# Altium project DC075B.PrjPcb (part 1 of 7)
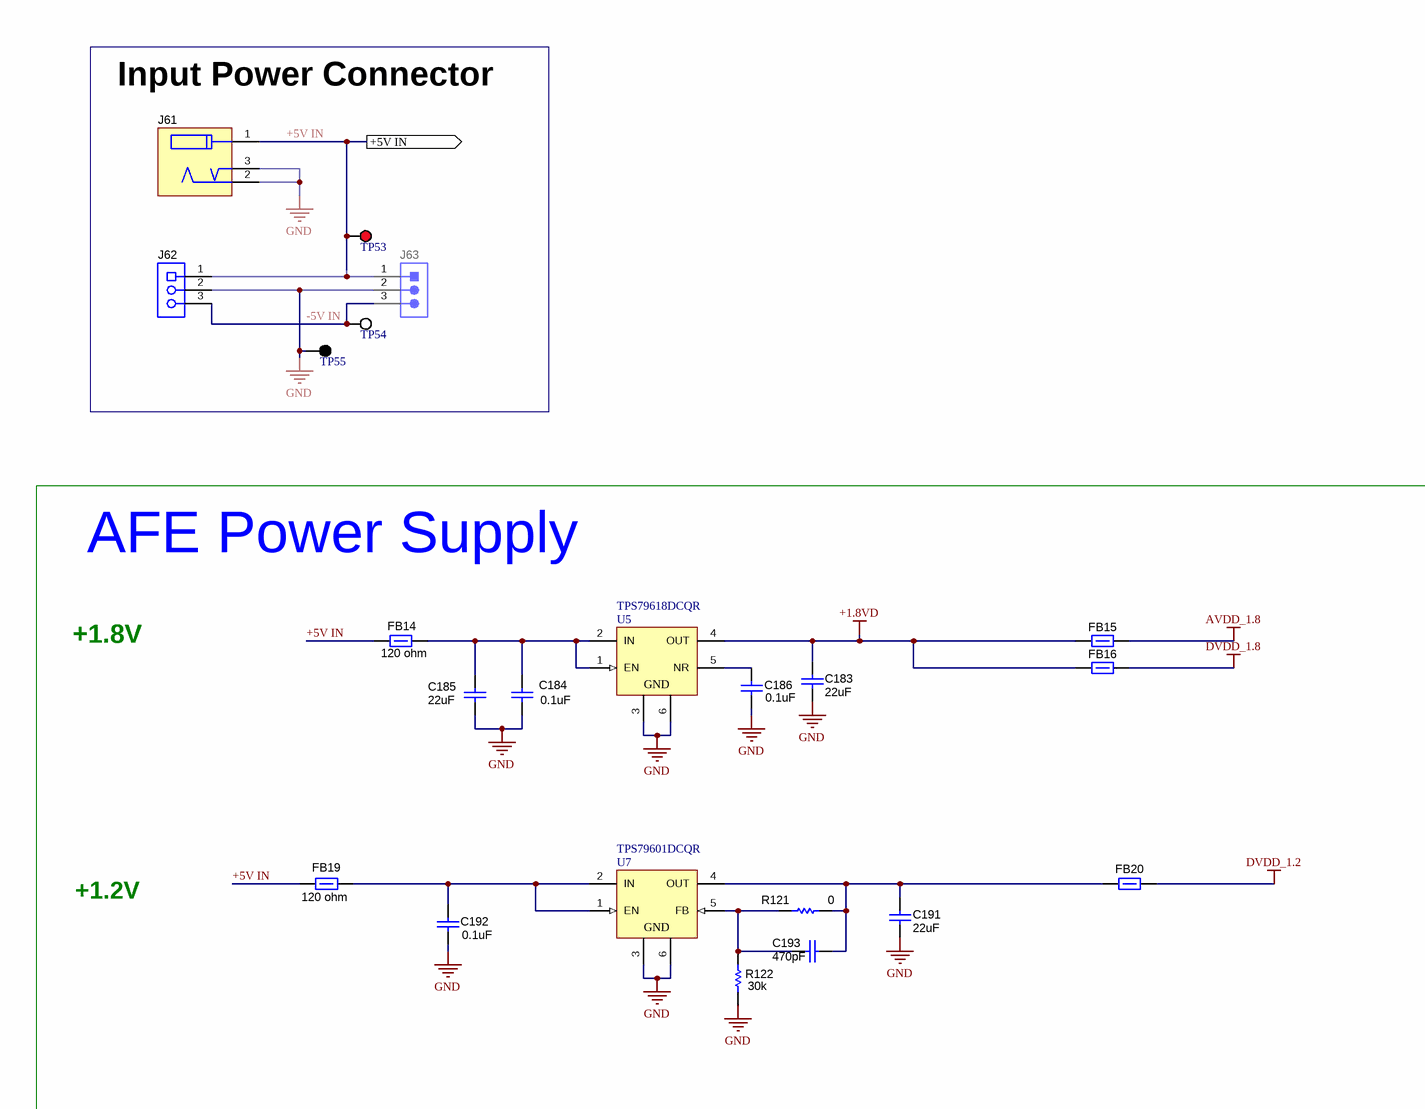
[diagram p0: DC075B_POWER_SUPPLIES.SchDoc, top left]
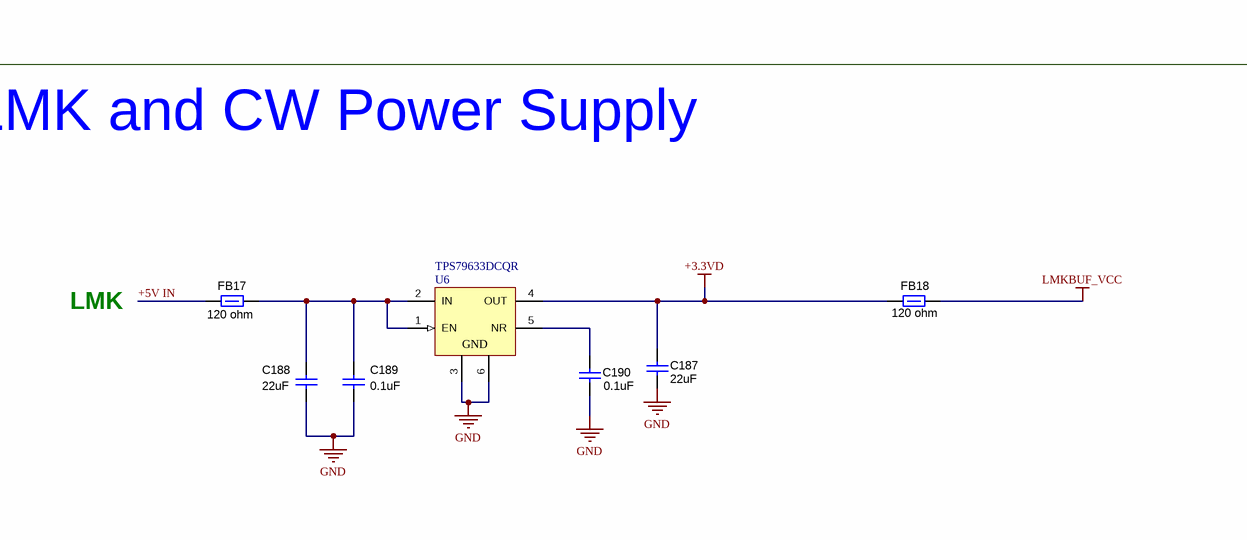
[diagram p1: DC075B_POWER_SUPPLIES.SchDoc, top right]
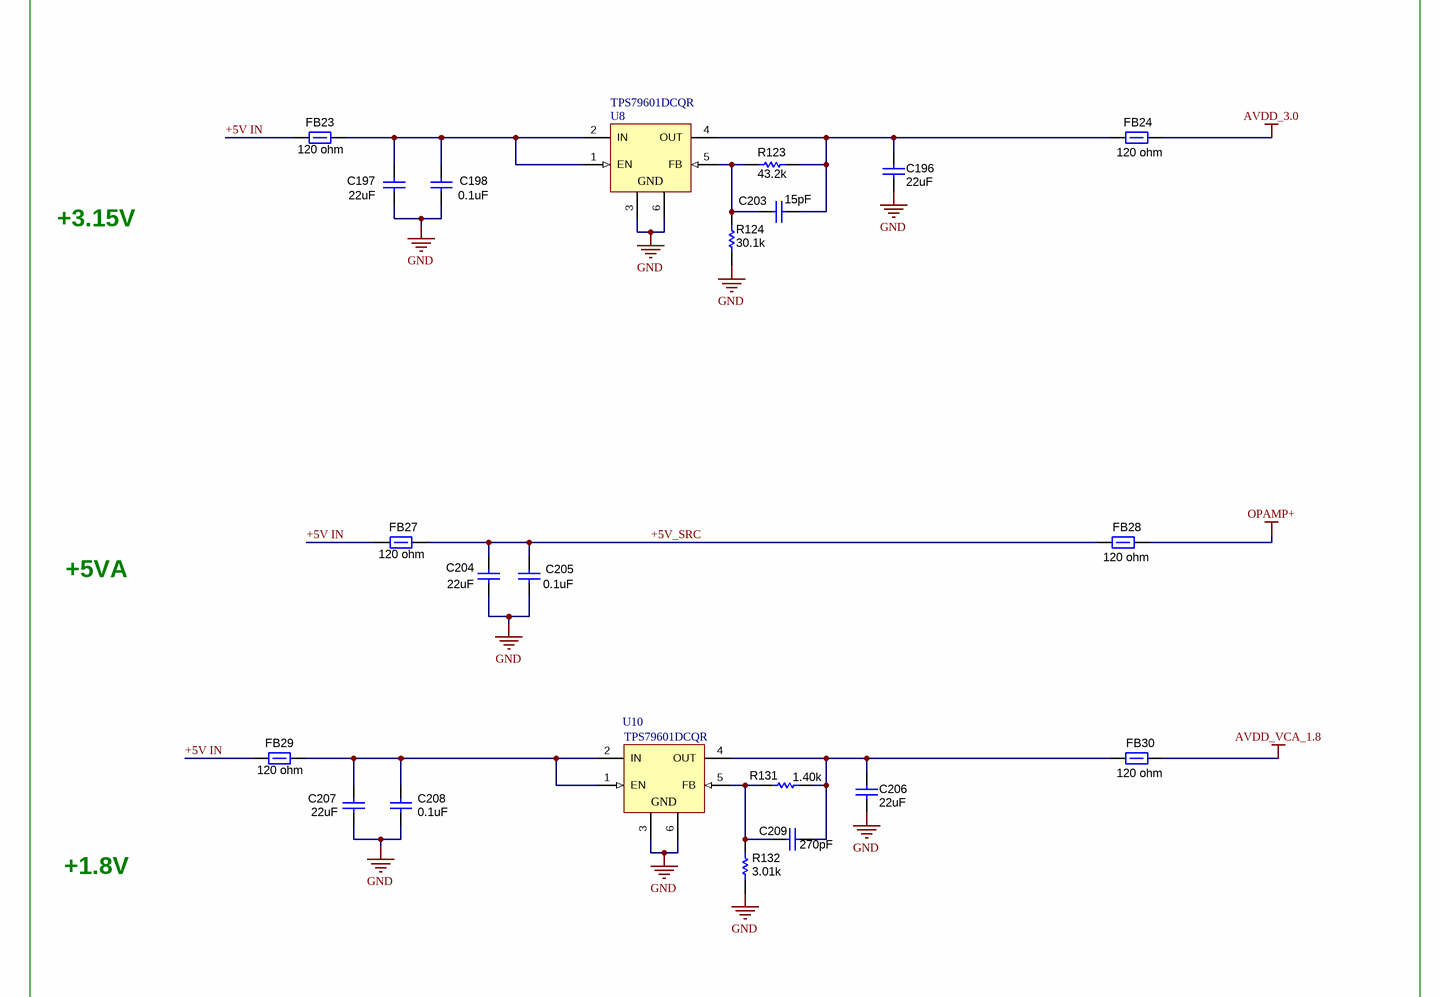
[diagram p2: DC075B_POWER_SUPPLIES.SchDoc, bottom left]
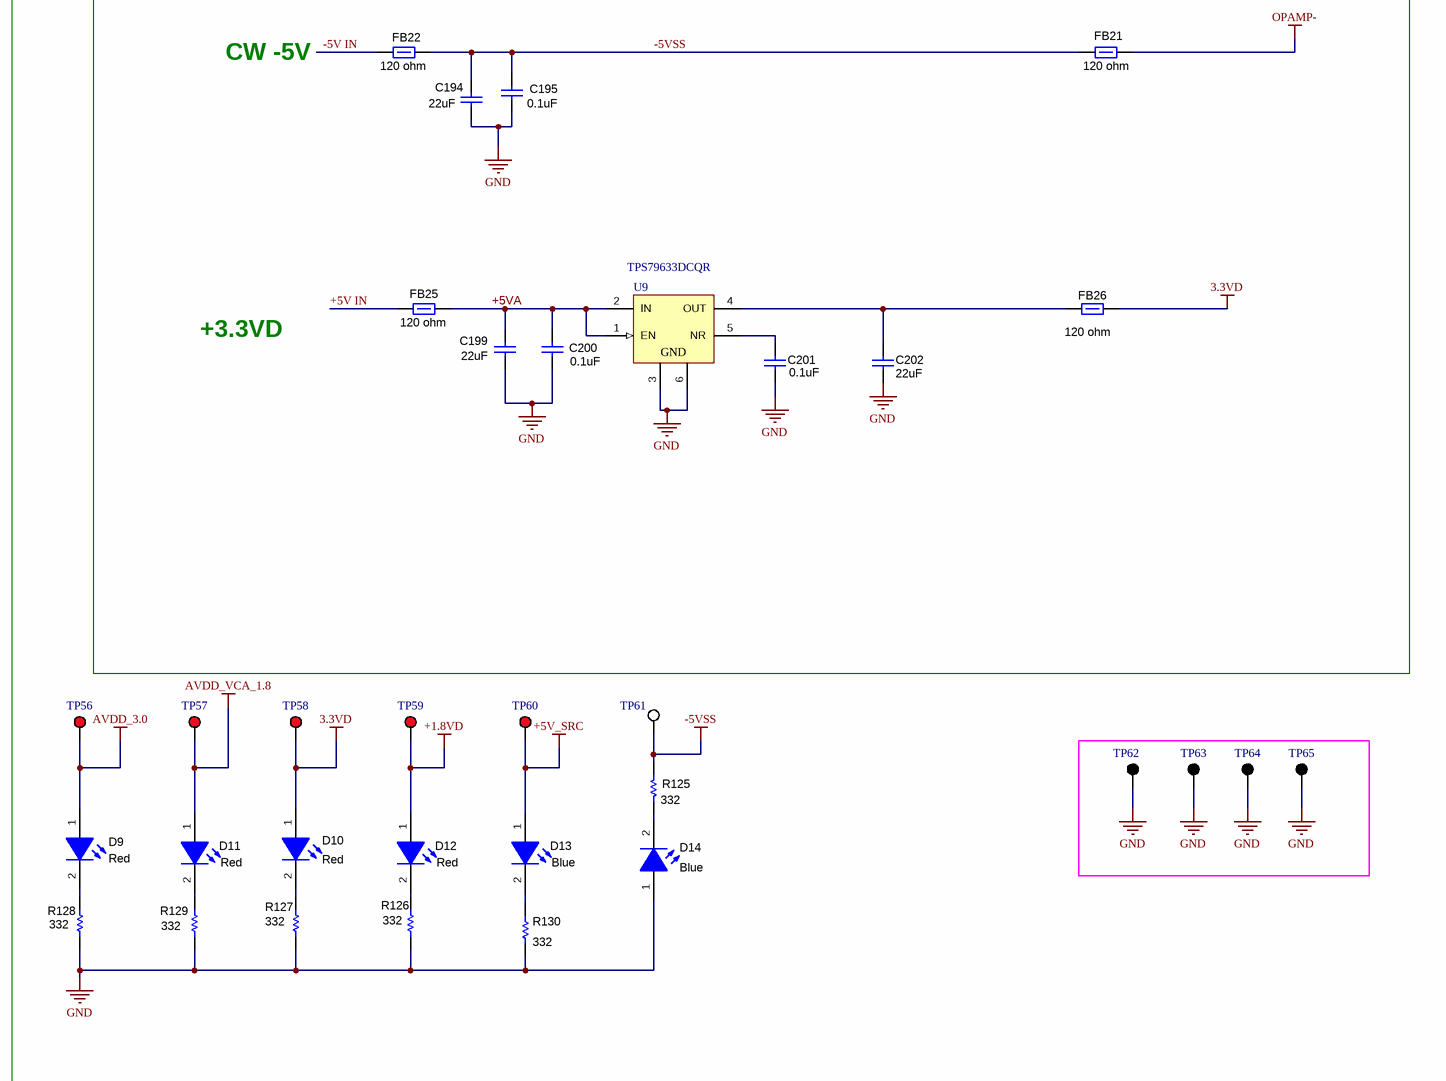
[diagram p3: DC075B_POWER_SUPPLIES.SchDoc, bottom right]
CopyrightYear: 2018; PCB_Layout: Tessolve; PCB_Rev: A; PRJ_Customer: Public Release; PRJ_Engineer: Praveen Aroul; PRJ_Number: DC075; PRJ_Title: AFE58JD32LP/AFE5832LP; SCH_Rev: B; TechSupport: http://www.ti.com/support; TID: N/A
13 sheets, 712 parts. Net scope: flat (ports and power ports of the same name join across sheets).
Board file: DC075B.PcbDoc
Sheets:
  DC075B_POWER_SUPPLIES.SchDoc
  DC075B_USB.SchDoc
  DC075B_INPUT_CLOCKS.SchDoc
  DC075B_LMK_CLOCK_CIRCUIT.SchDoc
  DC075B_ANALOG_INPUTS.SchDoc
  DC075B_DEVICE_PINOUT.SchDoc
  DC075B_DECOUPLING.SchDoc
  DC075B_TGC_SOURCE.SchDoc
  DC075B_DTGC_CPLD.SchDoc
  DC075B_LVDS_OUTPUT.SchDoc
  DC075B_JESD_OUTPUT.SchDoc
  DC075B_CW_OUTPUTS.SchDoc
  DC075B_HARDWARE.SchDoc

## Sheet DC075B_POWER_SUPPLIES.SchDoc: POWER SUPPLIES
size 558 x 431 mm; DrawnBy: Praveen Aroul; DocumentNumber: 1; SheetNumber: 1; SheetTotal: 13; PageSetup: Record=PageOptions|CenterHorizontal=True|CenterVertical=True|PrintScale=1.00|XCorrection=1.00|YCorrection=1.00|PrintKind=0|BorderSize=5000000|LeftOffset=0|BottomOffset=0|Orientation=2|PaperLength=1000|PaperWidth=1000|Scale=100|PaperSource=15|PrintQuality=600|MediaType=1|DitherType=10|PaperKind=Letter|PrintScaleMode=1

### Parts
C183  ValueDisplayed: 22uF  [0603]  (hidden comment: GRM187R61A226ME15D)
C184  value 0.1uF  [0603]  (hidden comment: CL10A104KA8NNNC)
C185  ValueDisplayed: 22uF  [1206_190]  (hidden comment: 1206YD226MAT2A)
C186  value 0.1uF  [0603]  (hidden comment: CL10A104KA8NNNC)
C187  ValueDisplayed: 22uF  [0603]  (hidden comment: GRM187R61A226ME15D)
C188  ValueDisplayed: 22uF  [1206_190]  (hidden comment: 1206YD226MAT2A)
C189  value 0.1uF  [0603]  (hidden comment: CL10A104KA8NNNC)
C190  value 0.1uF  [0603]  (hidden comment: CL10A104KA8NNNC)
C191  ValueDisplayed: 22uF  [0603]  (hidden comment: GRM187R61A226ME15D)
C192  value 0.1uF  [0603]  (hidden comment: CL10A104KA8NNNC)
C193  value 470pF  [0603]  (hidden comment: 06035A471JAT2A)
C194  ValueDisplayed: 22uF  [1206_190]  (hidden comment: 1206YD226MAT2A)
C195  value 0.1uF  [0603]  (hidden comment: CL10A104KA8NNNC)
C196  ValueDisplayed: 22uF  [0603]  (hidden comment: GRM187R61A226ME15D)
C197  ValueDisplayed: 22uF  [1206_190]  (hidden comment: 1206YD226MAT2A)
C198  value 0.1uF  [0603]  (hidden comment: CL10A104KA8NNNC)
C199  ValueDisplayed: 22uF  [1206_190]  (hidden comment: 1206YD226MAT2A)
C200  value 0.1uF  [0603]  (hidden comment: CL10A104KA8NNNC)
C201  value 0.1uF  [0603]  (hidden comment: CL10A104KA8NNNC)
C202  ValueDisplayed: 22uF  [0603]  (hidden comment: GRM187R61A226ME15D)
C203  ValueDisplayed: 15pF  [0603]  (hidden comment: 06035A150JAT2A)
C204  ValueDisplayed: 22uF  [1206_190]  (hidden comment: 1206YD226MAT2A)
C205  value 0.1uF  [0603]  (hidden comment: CL10A104KA8NNNC)
C206  ValueDisplayed: 22uF  [0603]  (hidden comment: GRM187R61A226ME15D)
C207  ValueDisplayed: 22uF  [1206_190]  (hidden comment: 1206YD226MAT2A)
C208  value 0.1uF  [0603]  (hidden comment: CL10A104KA8NNNC)
C209  Cap_F: 270pF  [0603]  (hidden comment: C0603C271K5RACTU)
D9  value Red  [LED_LTST-C190_Red]  (hidden comment: LTST-C190CKT)
D10  value Red  [LED_LTST-C190_Red]  (hidden comment: LTST-C190CKT)
D11  value Red  [LED_LTST-C190_Red]  (hidden comment: LTST-C190CKT)
D12  value Red  [LED_LTST-C190_Red]  (hidden comment: LTST-C190CKT)
D13  value Blue  [LB Q39G_BLUE]  (hidden comment: LB Q39G-L2N2-35-1)
D14  value Blue  [LB Q39G_BLUE]  (hidden comment: LB Q39G-L2N2-35-1)
FB14  value 120 ohm  [0805]  (hidden comment: BLM21AG121SN1D)
FB15  BLM21AG121SN1D  [0805]  (value not drawn)
FB16  BLM21AG121SN1D  [0805]  (value not drawn)
FB17  value 120 ohm  [0805]  (hidden comment: BLM21AG121SN1D)
FB18  value 120 ohm  [0805]  (hidden comment: BLM21AG121SN1D)
FB19  value 120 ohm  [0805]  (hidden comment: BLM21AG121SN1D)
FB20  BLM21AG121SN1D  [0805]  (value not drawn)
FB21  value 120 ohm  [0805]  (hidden comment: BLM21AG121SN1D)
FB22  value 120 ohm  [0805]  (hidden comment: BLM21AG121SN1D)
FB23  value 120 ohm  [0805]  (hidden comment: BLM21AG121SN1D)
FB24  value 120 ohm  [0805]  (hidden comment: BLM21AG121SN1D)
FB25  value 120 ohm  [0805]  (hidden comment: BLM21AG121SN1D)
FB26  value 120 ohm  [0805]  (hidden comment: BLM21AG121SN1D)
FB27  value 120 ohm  [0805]  (hidden comment: BLM21AG121SN1D)
FB28  value 120 ohm  [0805]  (hidden comment: BLM21AG121SN1D)
FB29  value 120 ohm  [0805]  (hidden comment: BLM21AG121SN1D)
FB30  value 120 ohm  [0805]  (hidden comment: BLM21AG121SN1D)
J61  RAPC722X  [CONN_RAPC722X]  (value not drawn)
J62  ED555/3DS  [TERM_BLK_ED555-3DS]  (value not drawn)
J63  TSW-103-07-G-S  [TSW-103-07-G-S]  (value not drawn)
R121  value 0  [0805_HV]  (hidden comment: CRCW08050000Z0EA)
R122  value 30k  [0805_HV]  (hidden comment: CRCW080530K0JNEA)
R123  ValueDisplayed: 43.2k  [0603]  (hidden comment: RC0603FR-0743K2L)
R124  ValueDisplayed: 30.1k  [0603]  (hidden comment: CRCW060330K1FKEA)
R125  value 332  [0402]  (hidden comment: CRCW0402332RFKED)
R126  value 332  [0402]  (hidden comment: CRCW0402332RFKED)
R127  value 332  [0402]  (hidden comment: CRCW0402332RFKED)
R128  value 332  [0402]  (hidden comment: CRCW0402332RFKED)
R129  value 332  [0402]  (hidden comment: CRCW0402332RFKED)
R130  value 332  [0402]  (hidden comment: CRCW0402332RFKED)
R131  ValueDisplayed: 1.40k  [0603]  (hidden comment: CRCW06031K40FKEA)
R132  value 3.01k  [0603]  (hidden comment: CRCW06033K01FKEA)
TP53  5000  [Keystone5000]  (value not drawn)
TP54  5002  [Keystone5002]  (value not drawn)
TP55  5001  [Keystone5001]  (value not drawn)
TP56  5000  [Keystone5000]  (value not drawn)
TP57  5000  [Keystone5000]  (value not drawn)
TP58  5000  [Keystone5000]  (value not drawn)
TP59  5000  [Keystone5000]  (value not drawn)
TP60  5000  [Keystone5000]  (value not drawn)
TP61  5002  [Keystone5002]  (value not drawn)
TP62  5001  [Keystone5001]  (value not drawn)
TP63  5001  [Keystone5001]  (value not drawn)
TP64  5001  [Keystone5001]  (value not drawn)
TP65  5001  [Keystone5001]  (value not drawn)
U5  TPS79618DCQR  [DCQ0006A_N]
U6  TPS79633DCQR  [DCQ0006A_N]
U7  TPS79601DCQR  [DCQ0006A_N]
U8  TPS79601DCQR  [DCQ0006A_N]
U9  TPS79633DCQR  [DCQ0006A_N]
U10  TPS79601DCQR  [DCQ0006A_N]

### Blocks framed on the sheet
Input Power Connector: J61-J63 TP53-TP55
AFE Power Supply: C183-C186 C191-C193 C196-C198 C203-C209 FB14-FB16 FB19 FB20 FB23 FB24 FB27-FB30 R121-R124 R131 R132 U5 U7 U8 U10
LMK and CW Power Supply: C187-C190 C194 C195 C199-C202 FB17 FB18 FB21 FB22 FB25 FB26 U6 U9

### Ports
+5V IN (out)

### Nets
3.3VD: D10.1(A) FB26.2 TP58.1
+1.8VD: C183.1 D12.1(A) FB15.1 FB16.1 TP59.1 U5.4(OUT)
+3.3VD: C187.1 FB18.1 U6.4(OUT)
+5V_SRC: C204.2 C205.1 D13.1(A) FB27.2 FB28.1 TP60.1
-5VSS: C194.2 C195.1 FB21.1 FB22.2 R125.1 TP61.1
AVDD_1.8: FB15.2
AVDD_3.0: D9.1(A) FB24.2 TP56.1
AVDD_VCA_1.8: D11.1(A) FB30.2 TP57.1
DVDD_1.2: FB20.2
DVDD_1.8: FB16.2
GND: C183.2 C184.2 C185.1 C186.2 C187.2 C188.1 C189.2 C190.2 C191.2 C192.2 C194.1 C195.2 C196.2 C197.1 C198.2 C199.1 C200.2 C201.2 C202.2 C204.1 C205.2 C206.2 C207.1 C208.2 D14.1(A) J61.2 J61.3 J62.2 J63.2 R122.1 R124.2 R126.1 R127.1 R128.1 R129.1 R130.1 R132.1 TP55.1 TP62.1 TP63.1 TP64.1 TP65.1 U5.3(GND) U5.6(GND) U6.3(GND) U6.6(GND) U7.3(GND) U7.6(GND) U8.3(GND) U8.6(GND) U9.3(GND) U9.6(GND) U10.3(GND) U10.6(GND)
LMKBUF_VCC: FB18.2
OPAMP+: FB28.2
OPAMP-: FB21.2
+5V IN: FB14.1 FB17.1 FB19.1 FB23.1 FB25.1 FB27.1 FB29.1 J61.1 J62.1 J63.1 TP53.1 ; port +5V IN
+5VA: C199.2 C200.1 FB25.2 U9.1(EN) U9.2(IN)
-5V IN: FB22.1 J62.3 J63.3 TP54.1
NetC184_1: C184.1 C185.2 FB14.2 U5.1(EN) U5.2(IN)
NetC186_1: C186.1 U5.5(NR)
NetC188_2: C188.2 C189.1 FB17.2 U6.1(EN) U6.2(IN)
NetC190_1: C190.1 U6.5(NR)
NetC191_1: C191.1 C193.1 FB20.1 R121.2 U7.4(OUT)
NetC192_1: C192.1 FB19.2 U7.1(EN) U7.2(IN)
NetC193_2: C193.2 R121.1 R122.2 U7.5(FB)
NetC196_1: C196.1 C203.1 FB24.1 R123.2 U8.4(OUT)
NetC197_2: C197.2 C198.1 FB23.2 U8.1(EN) U8.2(IN)
NetC201_1: C201.1 U9.5(NR)
NetC202_1: C202.1 FB26.1 U9.4(OUT)
NetC203_2: C203.2 R123.1 R124.1 U8.5(FB)
NetC206_1: C206.1 C209.1 FB30.1 R131.2 U10.4(OUT)
NetC207_2: C207.2 C208.1 FB29.2 U10.1(EN) U10.2(IN)
NetC209_2: C209.2 R131.1 R132.2 U10.5(FB)
NetD9_2: D9.2(K) R128.2
NetD10_2: D10.2(K) R127.2
NetD11_2: D11.2(K) R129.2
NetD12_2: D12.2(K) R126.2
NetD13_2: D13.2(K) R130.2
NetD14_2: D14.2(K) R125.2

### Notes on the sheet
- +1.8V
- LMK
- +1.2V
- CW -5V
- +3.15V
- +3.3VD
- +5VA
- Drawn By:
- SVN Rev:
- Number:
- TID #:
- Orderable:
- Rev:
- Sheet Title:
- File:
- Project Title:
- Designed for:
- Assembly Variant:
- Mod. Date:
- Sheet:
- Size:
- of
- C
- http://www.ti.com
- Texas Instruments and/or its licensors do not warrant the accuracy or completeness of this specification or any information contained therein. Texas Instruments and/or its licensors do not warrant that this design will meet the specifications, will be suitable for your application or fit for any particular purpose, or will operate in an implementation. Texas Instruments and/or its licensors do not warrant that the design is production worthy. You should completely validate and test your design implementation to confirm the system functionality for your application.
- Engineer:
- Contact:
- © Texas Instruments

### Library data of the parts
C183 C187 C191 C196 C202 C206 = CMP-0007158-5: CAP, CERM, 22 uF, 10 V, +/- 20%, X5R, 0603; Manufacturer: MuRata; Polarized: N; Value: 22uF; U/M: EA; Cap_F: 22µF; Value1: Unknown; VDC_V: 10V; TaMin_C: -55°C; TaMax_C: 85°C; AEC Category: Q200; SizeArea_mm2: 1.28; SizeAreaWB_mm2: 4.68; SizeX_mm: 1.6; SizeY_mm: 0.8; SizeZ_mm: 1; CompType: Capacitor; PartNumber: GRM187R61A226ME15D; PackageReference: 0603; RoHS: Y; Tolerance_%: 20%; Value2: 10V; MountType: SMT; Technology: Ceramic; TempCo: X5R; Cap_Case: 0603; Published: 2008-06-19; Publisher: Texas Instruments; LatestRevisionDate: 2017-03-09; ComponentLink1Description: Datasheet link; ComponentLink1URL: http://psearch.en.murata.com/capacitor/product/GRM187R61A226ME15%23.pdf; Supplier 1: Digi-Key; Supplier Part Number 1: 490-13243-1-ND; Supplier 2: Mouser; Supplier Part Number 2: 81-GRM187R61A226ME5D; AEC Qualified: N; AEC Grade: N/A
C184 C186 C189 C190 C192 C195 C198 C200 C201 C205 C208 = CMP-0085577-2: CAP, CERM, 0.1 µF, 25 V,+/- 10%, X5R, 0603; Manufacturer: Samsung Electro-Mechanics; Polarized: N; ValueDisplayed: 0.1µF; U/M: EA; Cap_F: 100nF; VDC_V: 25V; TaMin_C: -55°C; TaMax_C: 85°C; AEC Category: Q200; SizeArea_mm2: 1.28; SizeAreaWB_mm2: 4.68; SizeX_mm: 1.6; SizeY_mm: 0.8; SizeZ_mm: 1; Green_REACh: Incomplete; Green_Lifecycle: Active; CompType: Capacitor; PartNumber: CL10A104KA8NNNC; PackageReference: 0603; RoHS: Y; Tolerance_%: 10%; Value2: 25V; MountType: SMT; Technology: Ceramic; TempCo: X5R; Cap_Case: 0603; ComponentLink1Description: Datasheet link; ComponentLink1URL: http://www.samsungsem.com/kr/support/product-search/mlcc/__icsFiles/afieldfile/2018/06/20/CL10A104KA8NNNC.pdf; AEC Grade: N/A; AEC Qualified: N; Green_EU RoHS: Passed; Green_EU RoHS-2: Incomplete
C185 C188 C194 C197 C199 C204 C207 = CMP-0008571-2: CAP, CERM, 22 uF, 16 V, +/- 20%, X5R, 1206_190; Manufacturer: AVX; Polarized: N; Value: 22uF; U/M: EA; Cap_F: 22µF; Value1: Unknown; VDC_V: 16V; TaMin_C: -55°C; TaMax_C: 85°C; Cap_Case: 1206; AEC Category: Q200; SizeArea_mm2: 5.12; SizeAreaWB_mm2: 10.92; SizeX_mm: 3.2; SizeY_mm: 1.6; SizeZ_mm: 1.9; CompType: Capacitor; PartNumber: 1206YD226MAT2A; PackageReference: 1206_190; RoHS: Y; Tolerance_%: 20%; Value2: 16V; MountType: SMT; Technology: Ceramic; TempCo: X5R; Published: 2008-06-19; Publisher: Texas Instruments; LatestRevisionDate: 2017-03-09; ComponentLink1Description: Datasheet link; ComponentLink1URL: http://www.avx.com/docs/Catalogs/cx5r.pdf; Supplier 1: Digi-Key; Supplier Part Number 1: 478-5332-1-ND; Supplier 2: Newark; Supplier Part Number 2: 85R5734; Supplier 3: Mouser; Supplier Part Number 3: 581-1206YD226MAT2A; AEC Grade: N/A; AEC Qualified: N
C193 = CMP-0006790-4: CAP, CERM, 470 pF, 50 V, +/- 5%, C0G/NP0, 0603; Manufacturer: AVX; Polarized: N; U/M: EA; ESR_ohm: 0.063; Value1: 0.063 ohm; VDC_V: 50V; TaMin_C: -55°C; TaMax_C: 125°C; AEC Category: Q200; SizeArea_mm2: 1.28; SizeAreaWB_mm2: 4.68; SizeX_mm: 1.6; SizeY_mm: 0.8; SizeZ_mm: 1; CompType: Capacitor; PartNumber: 06035A471JAT2A; PackageReference: 0603; RoHS: Y; Cap_F: 470pF; Tolerance_%: 5%; Value2: 50V; MountType: SMT; Technology: Ceramic; TempCo: C0G/NP0; Cap_Case: 0603; Published: 2008-06-19; Publisher: Texas Instruments; LatestRevisionDate: 2017-03-09; ComponentLink1Description: Datasheet link; ComponentLink1URL: http://datasheets.avx.com/C0GNP0-Dielectric.pdf; Supplier 1: Digi-Key; Supplier Part Number 1: 478-1183-1-ND; Supplier 2: Newark; Supplier Part Number 2: 96M1279; Supplier 3: Mouser; Supplier Part Number 3: 581-06035A471J; AEC Grade: N/A; AEC Qualified: N; ValueDisplayed: 470pF
C203 = CMP-0006767-4: CAP, CERM, 15 pF, 50 V, +/- 5%, C0G/NP0, 0603; Manufacturer: AVX; Polarized: N; Value: 15pF; U/M: EA; ESR_ohm: 3.2d; Value1: 0.32 ohm; VDC_V: 50V; TaMin_C: -55°C; TaMax_C: 125°C; AEC Category: Q200; SizeArea_mm2: 1.28; SizeAreaWB_mm2: 4.68; SizeX_mm: 1.6; SizeY_mm: 0.8; SizeZ_mm: 1; CompType: Capacitor; PartNumber: 06035A150JAT2A; PackageReference: 0603; RoHS: Y; Cap_F: 15pF; Tolerance_%: 5%; Value2: 50V; MountType: SMT; Technology: Ceramic; TempCo: C0G/NP0; Cap_Case: 0603; Published: 2008-06-19; Publisher: Texas Instruments; LatestRevisionDate: 2017-03-09; ComponentLink1Description: Datasheet link; ComponentLink1URL: http://datasheets.avx.com/C0GNP0-Dielectric.pdf; Supplier 1: Digi-Key; Supplier Part Number 1: 478-1165-1-ND; Supplier 2: Newark; Supplier Part Number 2: 17C6475; Supplier 3: Mouser; Supplier Part Number 3: 581-06035A150J; AEC Grade: N/A; AEC Qualified: N
C209 = CMP-0006911-4: CAP, CERM, 270 pF, 50 V, +/- 10%, X7R, 0603; Manufacturer: Kemet; TaMin_C: -55°C; Polarized: N; SizeAreaWB_mm2: 4.68; Value1: Unknown; U/M: EA; Value: 270pF; TaMax_C: 125°C; SizeZ_mm: 1; SizeX_mm: 1.6; SizeY_mm: 0.8; Value2: 50V; SizeArea_mm2: 1.28; AEC Category: Q200; Supplier Part Number 2: 80-C0603C271K5R; Publisher: Texas Instruments; Supplier 2: Mouser; Supplier Part Number 3: 1758179; TempCo: X7R; Supplier 3: Farnell; Published: 2008-06-19; RoHS: Y; MountType: SMT; Supplier 1: Digi-Key; PackageReference: 0603; Tolerance_%: 10%; Cap_Case: 0603; CompType: Capacitor; LatestRevisionDate: 2017-03-09; PartNumber: C0603C271K5RACTU; AEC Qualified: ?; VDC_V: 50V; ComponentLink1Description: Datasheet link; Supplier Part Number 1: 399-1072-1-ND; Technology: Ceramic; ValueDisplayed: 270pF; ComponentLink1URL: http://www.kemet.com/kemet/web/homepage/kechome.nsf/vapubfiles/F3102_Y5V.pdf/$file/F3102_Y5V.pdf
D9-D12 = CMP-0002842-2: LED, Red, SMD; Manufacturer: Lite-On; Vf_V: 2V; Io_A: 20mA; Tjmax_C: 85°C; Power_TotalModule: 62.5mW; Value1: 0.0625W; CompType: LED; MountType: SMT; ComponentLink1URL: http://optoelectronics.liteon.com/en-us/api/DwonloadFileHandler.ashx?txtSpecNo=DS-22-98-0009&txtPartNo=LTST-C190CKT; ComponentLink1Description: Datasheet link; PackageReference: Red LED, 1.6x0.8x0.8mm; PartNumber: LTST-C190CKT; RoHS: Y; Type: ?; Value2: 2V; Color: red
D13 D14 = CMP-0002849-2: LED, Blue, SMD; Manufacturer: OSRAM; Vf_V: 2.85V; Io_A: 1.5dA; Tjmax_C: 95°C; Value1: W; CompType: LED; MountType: SMT; ComponentLink1URL: http://catalog.osram-os.com/catalogue/catalogue.do;jsessionid=8F4D5D14036503CDC6D844D9AC77EBC1?act=downloadFile&favOid=02000006000372cb000100b6; ComponentLink1Description: Datasheet link; PackageReference: BLUE 0603 LED; PartNumber: LB Q39G-L2N2-35-1; RoHS: Y; Type: ?; Value2: 2.85V; Color: blue
FB14 FB17-FB19 FB21-FB30 = CMP-0003358-1: Ferrite Bead, 120 ohm @ 100 MHz, 0.8 A, 0805; Manufacturer: MuRata; Imax_A: 8dA; DCR_ohm: 1d; Value1: 0.1 ohm; Value2: 0.8A; ZTyp@100MHz_Ohm: 120; SizeArea_mm2: 2.5; SizeAreaWB_mm2: 6.75; SizeX_mm: 2; SizeY_mm: 1.25; SizeZ_mm: 1.45; ComponentLink1Description: Datasheet link; ComponentLink1URL: http://search.murata.co.jp/Ceramy/image/img/PDF/ENG/L0110S0100BLM21A.pdf; CompType: Ferrite Bead; MountType: SMT; PackageReference: 0805; PartNumber: BLM21AG121SN1D; RoHS: Y; Published: 2014-04-30; Publisher: Texas Instruments; LatestRevisionDate: 2017-03-09; Supplier 1: Digi-Key; Supplier Part Number 1: 490-1038-1-ND; Supplier 2: Newark; Supplier Part Number 2: 73M9128; Supplier 3: Mouser; Supplier Part Number 3: 81-BLM21AG121SN1D; ValueDisplayed: 120 ohm
FB15 FB16 FB20 = CMP-0003358-1: Ferrite Bead, 120 ohm @ 100 MHz, 0.8 A, 0805; Manufacturer: MuRata; Value: 120 ohm; Imax_A: 8dA; DCR_ohm: 1d; Value1: 0.1 ohm; Value2: 0.8A; ZTyp@100MHz_Ohm: 120; SizeArea_mm2: 2.5; SizeAreaWB_mm2: 6.75; SizeX_mm: 2; SizeY_mm: 1.25; SizeZ_mm: 1.45; ComponentLink1Description: Datasheet link; ComponentLink1URL: http://search.murata.co.jp/Ceramy/image/img/PDF/ENG/L0110S0100BLM21A.pdf; CompType: Ferrite Bead; MountType: SMT; PackageReference: 0805; PartNumber: BLM21AG121SN1D; RoHS: Y; Published: 2014-04-30; Publisher: Texas Instruments; LatestRevisionDate: 2017-03-09; Supplier 1: Digi-Key; Supplier Part Number 1: 490-1038-1-ND; Supplier 2: Newark; Supplier Part Number 2: 73M9128; Supplier 3: Mouser; Supplier Part Number 3: 81-BLM21AG121SN1D; ValueDisplayed: 120 ohm
J61 = CMP-0074940-1: Power Jack, mini, 2.1mm OD, R/A, TH; Manufacturer: Switchcraft; CNHeader: False; Green_Lifecycle: Not Set; Green_REACh: Incomplete; PartNumber: RAPC722X; PackageReference: Jack, 14.5x11x9mm; CompType: Power Jack; RoHS: Y; MountType: TH; ComponentLink1Description: Datasheet URL; ComponentLink1URL: http://www.switchcraft.com/Drawings/rapc722x_cd.pdf; Publisher: Texas Instruments; LatestRevisionDate: 2017-07-12; Supplier 1: Digi-Key; Supplier Part Number 1: SC1313-ND; Supplier 2: Newark; Supplier Part Number 2: 65K7786; Supplier 3: Mouser; Supplier Part Number 3: 502-RAPC722X; CT: False; Green_EU RoHS-2: Incomplete; Green_EU RoHS: Incomplete
J62 = CMP-0074916-1: Terminal Block, 3.5mm Pitch, 3x1, TH; Manufacturer: On-Shore Technology; Pitch_mm: 3.5; Gender: Female; Shrouded: N; Row_Count: 1; ContactFinish: Brass; Current_A: 6A; Voltage_V: 150V; Cert_CULUS: Y; Green_Lifecycle: Active; Green_REACh: Passed; CNHeader: False; CT: True; PartNumber: ED555/3DS; PackageReference: 10.5x8.2x6.5mm; CompType: Terminal Block; RoHS: Y; MountType: TH; ComponentLink1Description: Datasheet URL; ComponentLink1URL: http://on-shore.com/sites/default/files/manuals/ed555ds.pdf; Publisher: Texas Instruments; LatestRevisionDate: 2017-07-12; Supplier 1: Digi-Key; Supplier Part Number 1: ED1515-ND; PinCount: 3; Color: Grey; Cert_VDE: Y; Green_EU RoHS: Passed with Exemption; Green_EU RoHS-2: Passed
J63 = CMP-0075407-2: Header, 100mil, 3x1, Gold, TH; Manufacturer: Samtec; Cert_CSA: Y; Cert_CULUS: N; Current_A: 6.3A; Gender: Male; Green_Lifecycle: Active; Green_REACh: Passed; Pitch_mm: 2.54; Row_Count: 1; Voltage_V: 550V; PartNumber: TSW-103-07-G-S; ClassName: Header; PackageReference: 3x1 Header; CompType: Header; RoHS: Y; MountType: TH; ComponentLink1Description: Datasheet URL; ComponentLink1URL: http://samtec.com/ftppub/pdf/TSW_TH.PDF; Supplier 1: Digi-Key; Supplier Part Number 1: SAM1029-03-ND; Cert_UL: Y; Cert_VDE: N; Color: Black; ContactFinish: Gold; Green_EU RoHS-2: Passed; Green_EU RoHS: Passed; Orientation: Vertical; PinCount: 3; Shrouded: N
R121 = CMP-0020442-3: RES, 0, 5%, 0.125 W, AEC-Q200 Grade 0, 0805; Manufacturer: Vishay-Dale; Value_Code: 0000; Power_W: 125mW; Value2: 0.125W; VDC_V: 150V; TempCo: 200 ppm/C; EIA_Code: E24; AEC Category: Q200; AEC Qualified: Y; SizeArea_mm2: 2.5; SizeX_mm: 2; SizeY_mm: 1.25; SizeZ_mm: 1.45; CompType: Resistor; PartNumber: CRCW08050000Z0EA; PackageReference: 0805; RoHS: E; Res_ohm: 0; Tolerance_%: 5%; Value1: 5%; MountType: SMT; Technology: Thick Film; ComponentLink1Description: Datasheet link; ComponentLink1URL: http://www.vishay.com/docs/20035/dcrcwe3.pdf; Supplier 1: Digi-Key; Supplier Part Number 1: 541-0.0ACT-ND; Supplier 2: Newark; Supplier Part Number 2: 52K9721; Supplier 3: Mouser; Supplier Part Number 3: 71-CRCW0805-0-E3; AEC Grade: 0; ValueDisplayed: 0
R122 = CMP-0020524-3: RES, 30 k, 5%, 0.125 W, AEC-Q200 Grade 0, 0805; Manufacturer: Vishay-Dale; Value_Code: 30k0; Power_W: 125mW; Value2: 0.125W; VDC_V: 150V; TempCo: 200 ppm/C; EIA_Code: E24; AEC Category: Q200; AEC Grade: 0; AEC Qualified: Y; SizeArea_mm2: 2.5; SizeX_mm: 2; SizeY_mm: 1.25; SizeZ_mm: 1.45; CompType: Resistor; PartNumber: CRCW080530K0JNEA; PackageReference: 0805; RoHS: E; Res_ohm: 30k; Tolerance_%: 5%; Value1: 5%; MountType: SMT; Technology: Thick Film; ComponentLink1Description: Datasheet link; ComponentLink1URL: http://www.vishay.com/docs/20035/dcrcwe3.pdf; Supplier 1: Digi-Key; Supplier Part Number 1: 541-30KACT-ND; Supplier 2: Newark; Supplier Part Number 2: 59M6888; Supplier 3: Mouser; Supplier Part Number 3: 71-CRCW080530K0JNEA; ValueDisplayed: 30k
R123 = CMP-0023112-5: RES, 43.2 k, 1%, 0.1 W, 0603; Manufacturer: Yageo; Value: 43.2k; Value_Code: 43k2; Power_W: 100mW; Value2: 0.1W; VDC_V: 75V; TempCo: 100 ppm/C; EIA_Code: E96; AEC Category: Q200; AEC Qualified: N; SizeArea_mm2: 1.28; SizeX_mm: 1.6; SizeY_mm: 0.8; SizeZ_mm: 1; SizeAreaWB_mm2: 4.68; CompType: Resistor; PartNumber: RC0603FR-0743K2L; PackageReference: 0603; RoHS: Y; Res_ohm: 43.2k; Tolerance_%: 1%; Value1: 1%; MountType: SMT; Technology: Thick Film; ComponentLink1Description: Datasheet link; ComponentLink1URL: http://www.yageo.com/pdf/Pu-RC0603_51_PbFree_L_2.pdf; Supplier 1: Digi-Key; Supplier Part Number 1: 311-43.2KHRCT-ND; Supplier 2: Mouser; Supplier Part Number 2: 603-RC0603FR-0743K2L; AEC Grade: N/A
R124 = CMP-0022324-4: RES, 30.1 k, 1%, 0.1 W, AEC-Q200 Grade 0, 0603; Manufacturer: Vishay-Dale; Value: 30.1k; Value_Code: 30k1; Power_W: 100mW; Value2: 0.1W; VDC_V: 75V; TempCo: 100 ppm/C; EIA_Code: E96; AEC Category: Q200; AEC Grade: 0; AEC Qualified: Y; SizeArea_mm2: 1.28; SizeX_mm: 1.6; SizeY_mm: 0.8; SizeZ_mm: 1; CompType: Resistor; PartNumber: CRCW060330K1FKEA; PackageReference: 0603; RoHS: E; Res_ohm: 30.1k; Tolerance_%: 1%; Value1: 1%; MountType: SMT; Technology: Thick Film; ComponentLink1Description: Datasheet link; ComponentLink1URL: http://www.vishay.com/docs/20035/dcrcwe3.pdf; Supplier 1: Digi-Key; Supplier Part Number 1: 541-30.1KHCT-ND; Supplier 2: Newark; Supplier Part Number 2: 52K8401; Supplier 3: Mouser; Supplier Part Number 3: 71-CRCW0603-30.1K-E3
R125-R130 = CMP-0026297-2: RES, 332, 1%, 0.063 W, AEC-Q200 Grade 0, 0402; Manufacturer: Vishay-Dale; Value_Code: 332R; Power_W: 63mW; Value2: 0.063W; VDC_V: 50V; TempCo: 100 ppm/C; EIA_Code: E96; AEC Category: Q200; AEC Grade: 0; AEC Qualified: Y; SizeArea_mm2: 0.5; SizeX_mm: 1; SizeZ_mm: 0.6; ComponentLink1Description: Datasheet link; ComponentLink1URL: http://www.vishay.com/docs/20035/dcrcwe3.pdf; CompType: Resistor; MountType: SMT; PackageReference: 0402; PartNumber: CRCW0402332RFKED; RoHS: E; ValueDisplayed: 332; Res_ohm: 332; Tolerance_%: 1%; Value1: 1%; Technology: Thick Film; Supplier 1: Digi-Key; Supplier Part Number 1: 541-332LCT-ND; Supplier 2: Newark; Supplier Part Number 2: 52K6984; Supplier 3: Mouser; Supplier Part Number 3: 71-CRCW0402-332-E3; SizeY_mm: 0.5
R131 = CMP-0022123-4: RES, 1.40 k, 1%, 0.1 W, AEC-Q200 Grade 0, 0603; Manufacturer: Vishay-Dale; Power_W: 100mW; TempCo: 100 ppm/C; Value_Code: 1k40; Value: 1.40k; EIA_Code: E96; Res_ohm: 1.4k; SizeX_mm: 1.6; SizeY_mm: 0.8; SizeZ_mm: 1; Value2: 0.1W; SizeArea_mm2: 1.28; AEC Qualified: Y; VDC_V: 75V; AEC Category: Q200; AEC Grade: 0; Supplier Part Number 2: 52K8034; Supplier 2: Newark; Supplier Part Number 3: 71-CRCW0603-1.4K-E3; Supplier 3: Mouser; RoHS: E; Value1: 1%; MountType: SMT; Supplier 1: Digi-Key; PackageReference: 0603; Tolerance_%: 1%; CompType: Resistor; PartNumber: CRCW06031K40FKEA; ComponentLink1Description: Datasheet link; Supplier Part Number 1: 541-1.40KHCT-ND; Technology: Thick Film; ComponentLink1URL: http://www.vishay.com/docs/20035/dcrcwe3.pdf
R132 = CMP-0022371-4: RES, 3.01 k, 1%, 0.1 W, AEC-Q200 Grade 0, 0603; Manufacturer: Vishay-Dale; Value_Code: 3k01; Power_W: 100mW; Value2: 0.1W; VDC_V: 75V; TempCo: 100 ppm/C; EIA_Code: E96; AEC Category: Q200; AEC Grade: 0; AEC Qualified: Y; SizeArea_mm2: 1.28; SizeX_mm: 1.6; SizeY_mm: 0.8; SizeZ_mm: 1; CompType: Resistor; PartNumber: CRCW06033K01FKEA; PackageReference: 0603; RoHS: E; Res_ohm: 3.01k; Tolerance_%: 1%; Value1: 1%; MountType: SMT; Technology: Thick Film; ComponentLink1Description: Datasheet link; ComponentLink1URL: http://www.vishay.com/docs/20035/dcrcwe3.pdf; Supplier 1: Digi-Key; Supplier Part Number 1: 541-3.01KHCT-ND; Supplier 2: Newark; Supplier Part Number 2: 52K8370; Supplier 3: Mouser; Supplier Part Number 3: 71-CRCW0603-3.01K-E3; ValueDisplayed: 3.01k
TP53 TP56-TP60 = CMP-0055137-1: Test Point, Miniature, Red, TH; Manufacturer: Keystone; CNHeader: FALSE; ContactFinish: Silver; CT: TRUE; Green_Lifecycle: Active; Green_REACh: Passed; PartNumber: 5000; PackageReference: Red Miniature Testpoint; CompType: Test Point; RoHS: Y; MountType: TH; ComponentLink1Description: Datasheet URL; ComponentLink1URL: http://www.keyelco.com/userAssets/file/M60-2p60.pdf; Publisher: Texas Instruments; LatestRevisionDate: 26/05/2017; Supplier 1: Digi-Key; Supplier Part Number 1: 36-5000-ND; Supplier 2: Mouser; Supplier Part Number 2: 534-5000; Color: Red; Green_EU RoHS-2: Incomplete; Green_EU RoHS: Passed
TP54 TP61 = CMP-0055139-1: Test Point, Miniature, White, TH; Manufacturer: Keystone; CNHeader: FALSE; ContactFinish: Silver; CT: TRUE; Green_Lifecycle: Active; Green_REACh: Passed; PartNumber: 5002; PackageReference: White Miniature Testpoint; CompType: Test Point; RoHS: Y; MountType: TH; ComponentLink1Description: Datasheet URL; ComponentLink1URL: http://www.keyelco.com/userAssets/file/M60-2p60.pdf; Publisher: Texas Instruments; LatestRevisionDate: 26/05/2017; Supplier 1: Digi-Key; Supplier Part Number 1: 36-5002-ND; Supplier 2: Newark; Supplier Part Number 2: 82H9632; Supplier 3: Mouser; Supplier Part Number 3: 534-5002; Color: White; Green_EU RoHS-2: Passed; Green_EU RoHS: Passed
TP55 TP62-TP65 = CMP-0055138-1: Test Point, Miniature, Black, TH; Manufacturer: Keystone; CNHeader: FALSE; ContactFinish: Silver; CT: TRUE; Green_Lifecycle: Active; Green_REACh: Passed; PartNumber: 5001; PackageReference: Black Miniature Testpoint; CompType: Test Point; RoHS: Y; MountType: TH; ComponentLink1Description: Datasheet URL; ComponentLink1URL: http://www.keyelco.com/userAssets/file/M60-2p60.pdf; Publisher: Texas Instruments; LatestRevisionDate: 26/05/2017; Supplier 1: Digi-Key; Supplier Part Number 1: 36-5001-ND; Supplier 2: Mouser; Supplier Part Number 2: 534-5001; Color: Black; Green_EU RoHS-2: Incomplete; Green_EU RoHS: Passed
U5 = CMP-0036702-1: Single Output High PSRR LDO, 1 A, Fixed 1.8 V Output, 2.7 to 5.5 V Input, 6-pin SOT-223 (DCQ), -40 to 125 degC, Green (RoHS & no Sb/Br); Manufacturer: Texas Instruments; Accuracy(%): 2; Fixed Output Options(V): 1.8; Iout(Max)(A): 1; Iq(Typ)(mA): 0.26; SubFamily: Single Channel LDO; Vdo(Typ)(mV): 250; Vin(Max)(V): 5.5; Vin(Min)(V): 2.7; PartNumber: TPS79618DCQR; PackageReference: DCQ0006A; ComponentLink1Description: Manufacturer URL; ComponentLink1URL: http://www.ti.com/; ComponentLink2Description: Datasheet; ComponentLink2URL: http://www.ti.com/general/docs/lit/getliterature.tsp?genericPartNumber=TPS79618&fileType=pdf; ComponentLink3Description: Package Specification; ComponentLink3URL: http://www.ti.com/litv/pdf/mpds098c; DatasheetVersion: SLVS351N; Eco-Plan: Green (RoHS & no Sb/Br); Mounting Technology: Surface Mount; PackageDescription: 6-Pin Plastic Small Outline, Body 3.5 x 6.5 mm, Pitch 1.27 mm; PackageVersion: 4202109/D; Vout Adj(Max)(V): 1.8; Vout Adj(Min)(V): 1.8
U6 U9 = CMP-0036713-1: Single Output High PSRR LDO, 1 A, Fixed 3.3 V Output, 2.7 to 5.5 V Input, 6-pin SOT-223 (DCQ), -40 to 125 degC, Green (RoHS & no Sb/Br); Manufacturer: Texas Instruments; Accuracy(%): 2; Fixed Output Options(V): 3.3; Iout(Max)(A): 1; Iq(Typ)(mA): 0.26; SubFamily: Single Channel LDO; Vdo(Typ)(mV): 220; Vin(Max)(V): 5.5; Vin(Min)(V): 2.7; DatasheetVersion: SLVS351N; PackageVersion: 4202109/D; PackageReference: DCQ0006A; PackageDescription: 6-Pin Plastic Small Outline, Body 3.5 x 6.5 mm, Pitch 1.27 mm; Eco-Plan: Green (RoHS & no Sb/Br); Vout Adj(Max)(V): 3.3; Vout Adj(Min)(V): 3.3; PartNumber: TPS79633DCQR; ComponentLink1Description: Manufacturer URL; ComponentLink1URL: http://www.ti.com/; ComponentLink2Description: Datasheet; ComponentLink2URL: http://www.ti.com/general/docs/lit/getliterature.tsp?genericPartNumber=TPS79633&fileType=pdf; ComponentLink3Description: Package Specification; ComponentLink3URL: http://www.ti.com/litv/pdf/mpds098c; Mounting Technology: Surface Mount
U7 U8 U10 = CMP-0036699-1: Single Output High PSRR LDO, 1 A, Adjustable 1.2 to 5.5 V Output, 2.7 to 5.5 V Input, 6-pin SOT-223 (DCQ), -40 to 125 degC, Green (RoHS & no Sb/Br); Manufacturer: Texas Instruments; Accuracy(%): 2; Iout(Max)(A): 1; Iq(Typ)(mA): 0.26; SubFamily: Single Channel LDO; Vdo(Typ)(mV): 250; Vin(Max)(V): 5.5; Vin(Min)(V): 2.7; Vout Adj(Min)(V): 1.2; PartNumber: TPS79601DCQR; PackageReference: DCQ0006A; ComponentLink1Description: Manufacturer URL; ComponentLink1URL: http://www.ti.com/; ComponentLink2Description: Datasheet; ComponentLink2URL: http://www.ti.com/general/docs/lit/getliterature.tsp?genericPartNumber=TPS79601&fileType=pdf; ComponentLink3Description: Package Specification; ComponentLink3URL: http://www.ti.com/litv/pdf/mpds098c; DatasheetVersion: SLVS351N; Eco-Plan: Green (RoHS & no Sb/Br); Mounting Technology: Surface Mount; PackageDescription: 6-Pin Plastic Small Outline, Body 3.5 x 6.5 mm, Pitch 1.27 mm; PackageVersion: 4202109/D; Vout Adj(Max)(V): 5.5

## Sheet DC075B_USB.SchDoc: USB<->SPI
size 558 x 431 mm; DrawnBy: Praveen Aroul; DocumentNumber: 2; SheetNumber: 2; SheetTotal: 13; PageSetup: Record=PageOptions|CenterHorizontal=True|CenterVertical=True|PrintScale=1.00|XCorrection=1.00|YCorrection=1.00|PrintKind=0|BorderSize=5000000|LeftOffset=0|BottomOffset=0|Orientation=2|PaperLength=1000|PaperWidth=1000|Scale=100|PaperSource=15|PrintQuality=600|MediaType=1|DitherType=10|PaperKind=Letter|PrintScaleMode=1
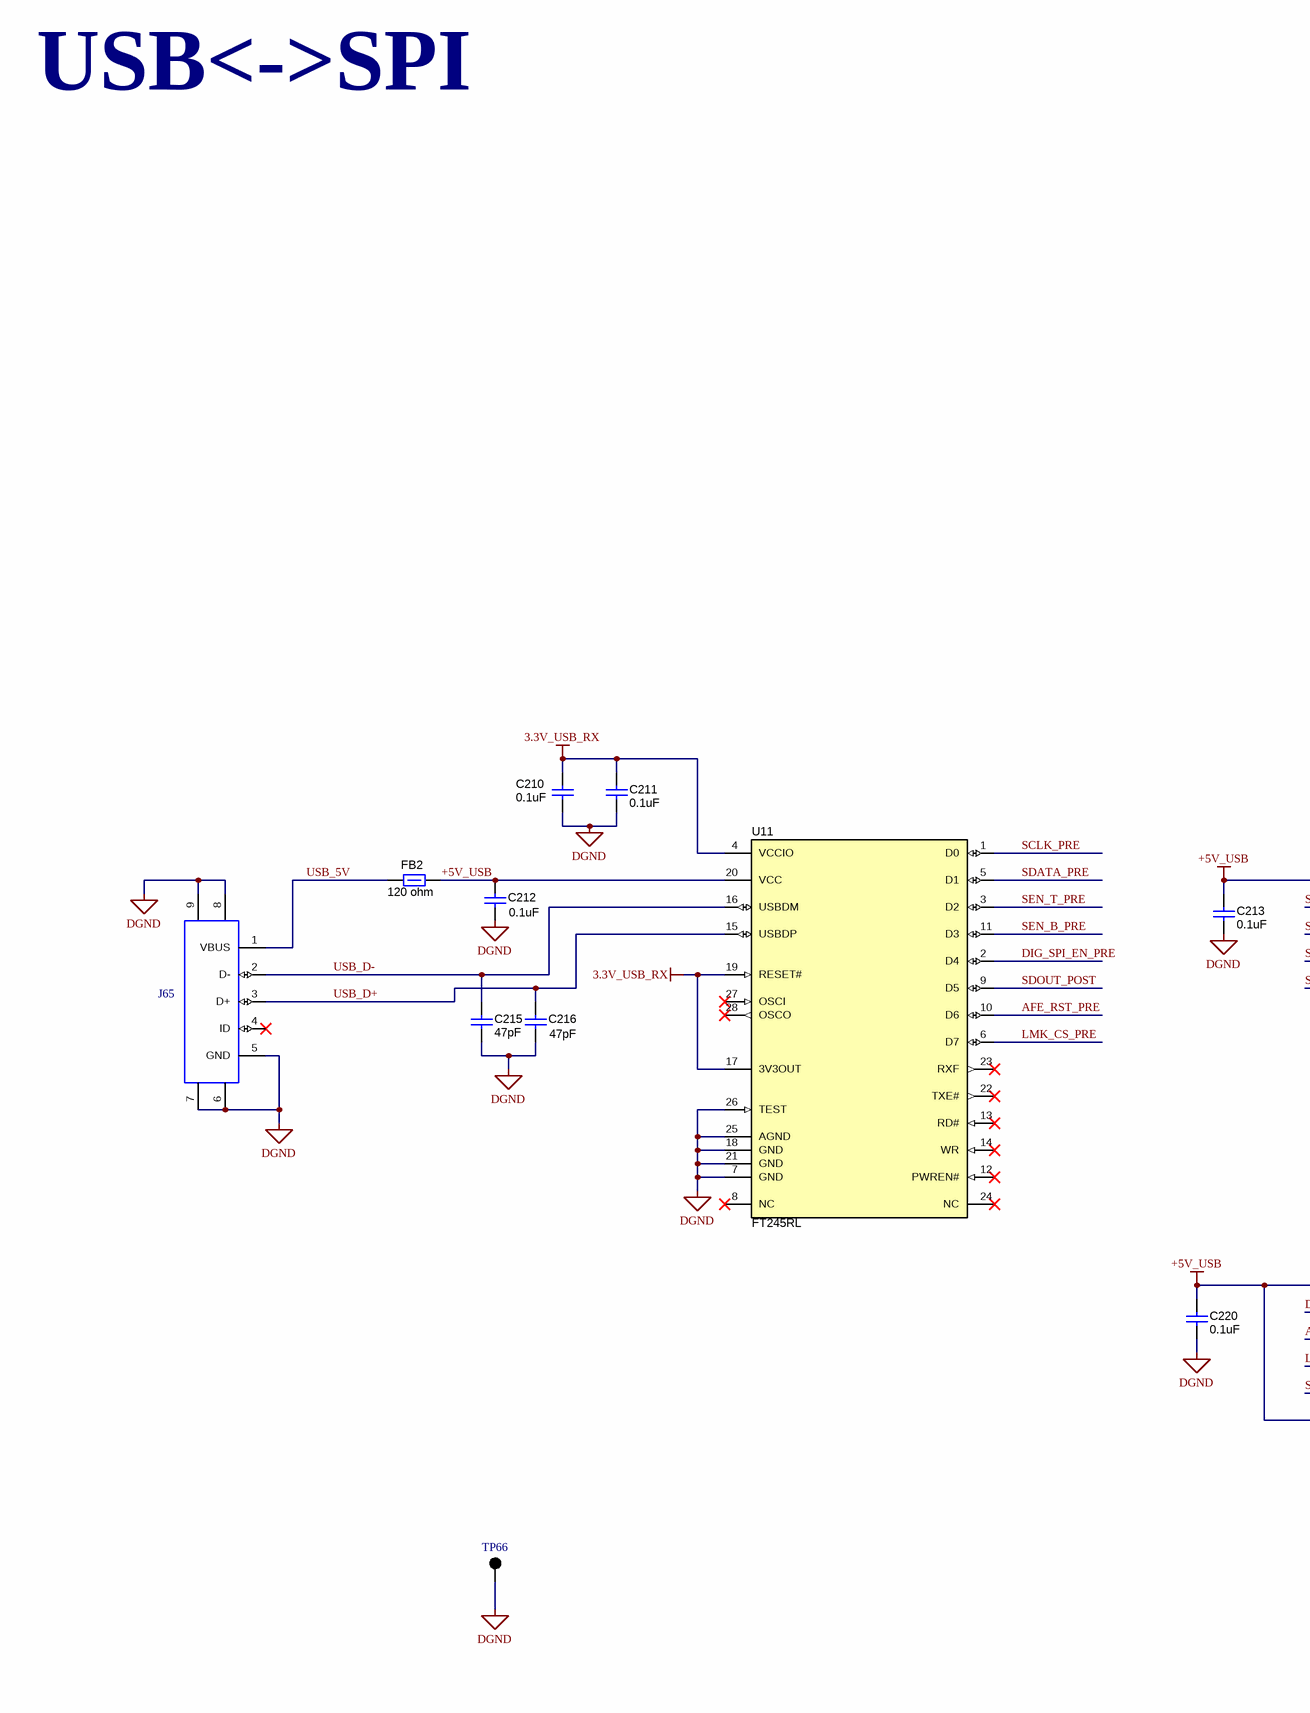
[diagram p4: DC075B_USB.SchDoc, left]
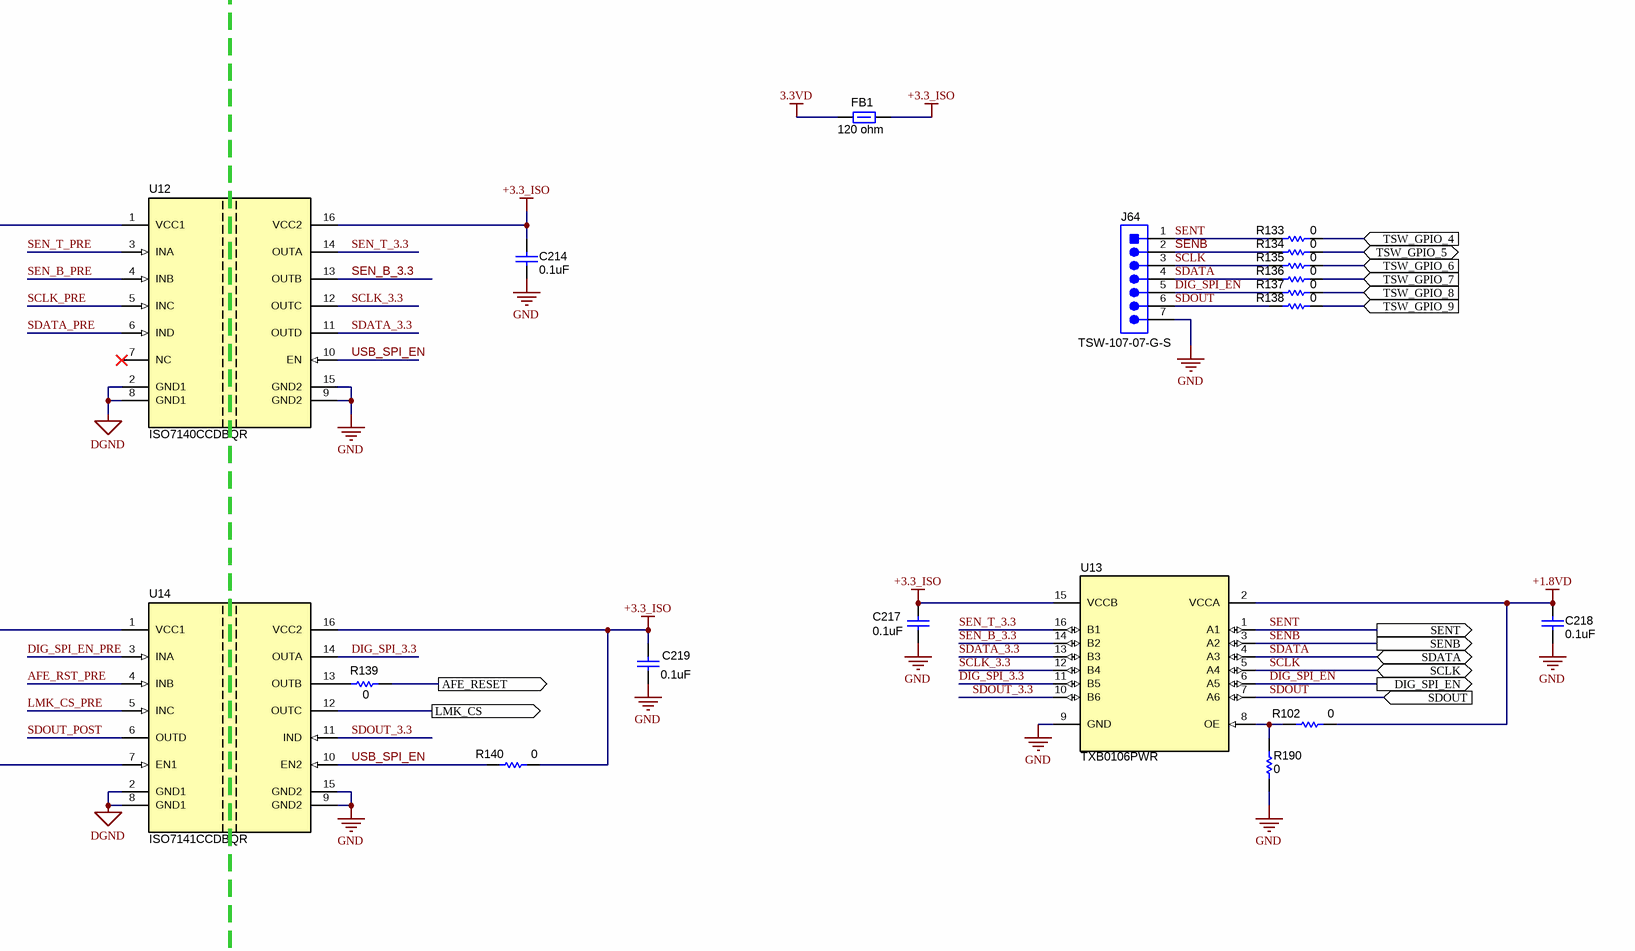
[diagram p5: DC075B_USB.SchDoc, right]

### Parts
C210  value 0.1uF  [0402]  (hidden comment: GRM155R71C104KA88D)
C211  value 0.1uF  [0402]  (hidden comment: GRM155R71C104KA88D)
C212  value 0.1uF  [0402]  (hidden comment: GRM155R71C104KA88D)
C213  value 0.1uF  [0402]  (hidden comment: GRM155R71C104KA88D)
C214  value 0.1uF  [0402]  (hidden comment: GRM155R71C104KA88D)
C215  value 47pF  [0402]  (hidden comment: GRM1555C1H470FA01D)
C216  value 47pF  [0402]  (hidden comment: GRM1555C1H470FA01D)
C217  value 0.1uF  [0402]  (hidden comment: GRM155R71C104KA88D)
C218  value 0.1uF  [0402]  (hidden comment: GRM155R71C104KA88D)
C219  value 0.1uF  [0402]  (hidden comment: GRM155R71C104KA88D)
C220  value 0.1uF  [0402]  (hidden comment: GRM155R71C104KA88D)
FB1  value 120 ohm  [0805]  (hidden comment: BLM21AG121SN1D)
FB2  value 120 ohm  [0805]  (hidden comment: BLM21AG121SN1D)
J64  TSW-107-07-G-S  [TSW-107-07-G-S]
J65  67803-8020  [Molex_67803-8020]  (value not drawn)
R102  value 0  [0402]  (hidden comment: CRCW04020000Z0ED)
R133  value 0  [0402]  (hidden comment: CRCW04020000Z0ED)
R134  value 0  [0402]  (hidden comment: CRCW04020000Z0ED)
R135  value 0  [0402]  (hidden comment: CRCW04020000Z0ED)
R136  value 0  [0402]  (hidden comment: CRCW04020000Z0ED)
R137  value 0  [0402]  (hidden comment: CRCW04020000Z0ED)
R138  value 0  [0402]  (hidden comment: CRCW04020000Z0ED)
R139  value 0  [0402]  (hidden comment: CRCW04020000Z0ED)
R140  value 0  [0402]  (hidden comment: CRCW04020000Z0ED)
R190  value 0  [0402]  (hidden comment: CRCW04020000Z0ED)
TP66  5001  [Keystone5001]  (value not drawn)
U11  FT245RL  [SSOP28_N]
U12  ISO7140CCDBQR  [DBQ0016A_N]
U13  TXB0106PWR  [PW0016A_N]
U14  ISO7141CCDBQR  [DBQ0016A_N]

### Ports
AFE_RESET (out), DIG_SPI_EN (out), LMK_CS (out), SCLK, SDATA, SDOUT (in), SENB (out), SENT (out), TSW_GPIO_4 (in), TSW_GPIO_5, TSW_GPIO_6 (in), TSW_GPIO_7 (in), TSW_GPIO_8 (in), TSW_GPIO_9 (in)

### Nets
3.3V_USB_RX: C210.2 C211.2 U11.4(VCCIO) U11.17(3V3OUT) U11.19(RESET#)
3.3VD: FB1.2
+1.8VD: C218.2 R102.1 U13.2(VCCA)
+3.3_ISO: C214.2 C217.2 C219.2 FB1.1 R140.1 U12.16(VCC2) U13.15(VCCB) U14.16(VCC2)
+5V_USB: C212.1 C213.1 C220.1 FB2.1 U11.20(VCC) U12.1(VCC1) U14.1(VCC1) U14.7(EN1)
DGND: C210.1 C211.1 C212.2 C213.2 C215.2 C216.2 C220.2 J65.5(GND) J65.6 J65.7 J65.8 J65.9 TP66.1 U11.7(GND) U11.18(GND) U11.21(GND) U11.25(AGND) U11.26(TEST) U12.2(GND1) U12.8(GND1) U14.2(GND1) U14.8(GND1)
GND: C214.1 C217.1 C218.1 C219.1 J64.7 R190.2 U12.9(GND2) U12.15(GND2) U13.9(GND) U14.9(GND2) U14.15(GND2)
AFE_RESET: R139.1 ; port AFE_RESET
AFE_RST_PRE: U11.10(D6) U14.4(INB)
DIG_SPI_3.3: U13.11(B5) U14.14(OUTA)
DIG_SPI_EN: J64.5 R137.2 U13.6(A5) ; port DIG_SPI_EN
DIG_SPI_EN_PRE: U11.2(D4) U14.3(INA)
LMK_CS: U14.12(OUTC) ; port LMK_CS
LMK_CS_PRE: U11.6(D7) U14.5(INC)
SCLK: J64.3 R135.2 U13.5(A4) ; port SCLK
SCLK_3.3: U12.12(OUTC) U13.12(B4)
SCLK_PRE: U11.1(D0) U12.5(INC)
SDATA: J64.4 R136.2 U13.4(A3) ; port SDATA
SDATA_3.3: U12.11(OUTD) U13.13(B3)
SDATA_PRE: U11.5(D1) U12.6(IND)
SDOUT: J64.6 R138.2 U13.7(A6) ; port SDOUT
SDOUT_3.3: U13.10(B6) U14.11(IND)
SDOUT_POST: U11.9(D5) U14.6(OUTD)
SEN_B_3.3: U12.13(OUTB) U13.14(B2)
SEN_B_PRE: U11.11(D3) U12.4(INB)
SEN_T_3.3: U12.14(OUTA) U13.16(B1)
SEN_T_PRE: U11.3(D2) U12.3(INA)
SENB: J64.2 R134.2 U13.3(A2) ; port SENB
SENT: J64.1 R133.2 U13.1(A1) ; port SENT
TSW_GPIO_4: R133.1 ; port TSW_GPIO_4
TSW_GPIO_5: R134.1 ; port TSW_GPIO_5
TSW_GPIO_6: R135.1 ; port TSW_GPIO_6
TSW_GPIO_7: R136.1 ; port TSW_GPIO_7
TSW_GPIO_8: R137.1 ; port TSW_GPIO_8
TSW_GPIO_9: R138.1 ; port TSW_GPIO_9
USB_5V: FB2.2 J65.1(VBUS)
USB_D+: C216.1 J65.3(D+) U11.15(USBDP)
USB_D-: C215.1 J65.2(D-) U11.16(USBDM)
USB_SPI_EN: R140.2 U12.10(EN) U14.10(EN2)
NetR102_2: R102.2 R190.1 U13.8(OE)
NetR139_2: R139.2 U14.13(OUTB)

Not connected (* = marked no-connect by the designer): J65 4(ID)*; U11 8(NC)* 12(PWREN#)* 13(RD#)* 14(WR)* 22(TXE#)* 23(RXF)* 24(NC)* 27(OSCI)* 28(OSCO)*; U12 7(NC)*

### Notes on the sheet
- USB<->SPI
- Drawn By:
- SVN Rev:
- Number:
- TID #:
- Orderable:
- Rev:
- Sheet Title:
- File:
- Project Title:
- Designed for:
- Assembly Variant:
- Mod. Date:
- Sheet:
- Size:
- of
- C
- http://www.ti.com
- Texas Instruments and/or its licensors do not warrant the accuracy or completeness of this specification or any information contained therein. Texas Instruments and/or its licensors do not warrant that this design will meet the specifications, will be suitable for your application or fit for any particular purpose, or will operate in an implementation. Texas Instruments and/or its licensors do not warrant that the design is production worthy. You should completely validate and test your design implementation to confirm the system functionality for your application.
- Engineer:
- Contact:
- © Texas Instruments

### Library data of the parts
C210-C214 C217-C220 = CMP-0006641-2: CAP, CERM, 0.1 uF, 16 V, +/- 10%, X7R, 0402; Manufacturer: MuRata; Polarized: N; U/M: EA; Cap_F: 100nF; Value1: Unknown; VDC_V: 16V; TaMin_C: -55°C; TaMax_C: 125°C; AEC Category: Q200; SizeArea_mm2: 0.5; SizeAreaWB_mm2: 3; SizeX_mm: 1; SizeZ_mm: 0.6; CompType: Capacitor; PartNumber: GRM155R71C104KA88D; PackageReference: 0402; RoHS: Y; MountType: SMT; ComponentLink1Description: Datasheet link; ComponentLink1URL: http://search.murata.co.jp/Ceramy/PnsearchViewAction.do?HnOFG=ON&HnNFG=ON&SEL_CNT=50&sLang=en&sKey=GRM155R71C104KA88D&x=9&y=9&search=startwith; ValueDisplayed: 0.1uF; Tolerance_%: 10%; Value2: 16V; Technology: Ceramic; TempCo: X7R; Cap_Case: 0402; Published: 2008-06-19; Publisher: Texas Instruments; LatestRevisionDate: 2017-03-09; Supplier 1: Digi-Key; Supplier Part Number 1: 490-3261-1-ND; Supplier 2: Newark; Supplier Part Number 2: 38K1647; Supplier 3: Mouser; Supplier Part Number 3: 81-GRM155R71C104KA88; AEC Qualified: ?; SizeY_mm: 0.5
C215 C216 = CMP-0006467-2: CAP, CERM, 47 pF, 50 V, +/- 1%, C0G/NP0, 0402; Manufacturer: MuRata; Polarized: N; U/M: EA; Value1: Unknown; VDC_V: 50V; TaMin_C: -55°C; TaMax_C: 125°C; AEC Category: Q200; SizeArea_mm2: 0.5; SizeAreaWB_mm2: 3; SizeX_mm: 1; SizeZ_mm: 0.6; CompType: Capacitor; PartNumber: GRM1555C1H470FA01D; PackageReference: 0402; RoHS: Y; MountType: SMT; ComponentLink1Description: Datasheet link; ComponentLink1URL: http://www.murata.com/~/media/webrenewal/support/library/catalog/products/capacitor/mlcc/c02e.ashx; ValueDisplayed: 47pF; Cap_F: 47pF; Tolerance_%: 1%; Value2: 50V; Technology: Ceramic; TempCo: C0G/NP0; Cap_Case: 0402; Published: 2008-06-19; Publisher: Texas Instruments; LatestRevisionDate: 2017-03-09; Supplier 1: Digi-Key; Supplier Part Number 1: 490-6241-1-ND; Supplier 2: Mouser; Supplier Part Number 2: 81-GRM1555C1H470FA1D; AEC Qualified: ?; SizeY_mm: 0.5
FB1 FB2 = CMP-0003358-1: as FB14 on sheet DC075B_POWER_SUPPLIES; ComponentLink1Description: Datasheet link; ComponentLink1URL: http://search.murata.co.jp/Ceramy/image/img/PDF/ENG/L0110S0100BLM21A.pdf; CompType: Ferrite Bead; MountType: SMT; PackageReference: 0805; PartNumber: BLM21AG121SN1D; RoHS: Y; Published: 2014-04-30; Publisher: Texas Instruments; LatestRevisionDate: 2017-03-09; Supplier 1: Digi-Key; Supplier Part Number 1: 490-1038-1-ND; Supplier 2: Newark; Supplier Part Number 2: 73M9128; Supplier 3: Mouser; Supplier Part Number 3: 81-BLM21AG121SN1D; ValueDisplayed: 120 ohm
J64 = CMP-0075416-1: Header, 100mil, 7x1, Gold, TH; Manufacturer: Samtec; Pitch_mm: 2.54; Gender: Male; Shrouded: N; Row_Count: 1; Current_A: 6.3A; Voltage_V: 550V; Cert_CSA: Y; CNHeader: True; CT: False; Green_Lifecycle: Active; Green_REACh: Passed; PartNumber: TSW-107-07-G-S; PackageReference: 7x1 Header; ClassName: Header; CompType: Header; RoHS: Y; MountType: TH; ComponentLink1Description: Datasheet URL; ComponentLink1URL: http://samtec.com/ftppub/pdf/TSW_TH.PDF; Orientation: Vertical; PinCount: 7; ContactFinish: Gold; Color: Black; Cert_UL: Y; Cert_CULUS: N; Cert_VDE: N; Publisher: Texas Instruments; LatestRevisionDate: 2017-07-12; Supplier 1: Digi-Key; Supplier Part Number 1: SAM1029-07-ND; Green_EU RoHS-2: Passed; Green_EU RoHS: Passed
J65 = CMP-0055303-1: Connector, Receptacle, USB - mini AB, R/A, SMD; Manufacturer: Molex; CNHeader: FALSE; CT: TRUE; Gender: Female; PartNumber: 67803-8020; PackageReference: Receptacle, 5-Leads, Body 9.9x9mm, R/A; CompType: USB; RoHS: Y; MountType: SMT; ComponentLink1Description: Datasheet URL; ComponentLink1URL: http://www.molex.com/pdm_docs/sd/678038020_sd.pdf; Publisher: Texas Instruments; LatestRevisionDate: 26/05/2017; Supplier 1: Digi-Key; Supplier Part Number 1: WM17148CT-ND; Supplier 2: Newark; Supplier Part Number 2: 06X9412; Supplier 3: Mouser; Supplier Part Number 3: 538-67803-8020
R102 R133-R140 R190 = CMP-0026822-3: RES, 0, 5%, 0.063 W, AEC-Q200 Grade 0, 0402; Manufacturer: Vishay-Dale; Value_Code: 0000; Power_W: 63mW; Value2: 0.063W; VDC_V: 50V; TempCo: 200 ppm/C; EIA_Code: E24; AEC Category: Q200; AEC Qualified: Y; SizeArea_mm2: 0.5; SizeX_mm: 1; SizeZ_mm: 0.6; ComponentLink1Description: Datasheet link; ComponentLink1URL: http://www.vishay.com/docs/20035/dcrcwe3.pdf; CompType: Resistor; MountType: SMT; PackageReference: 0402; PartNumber: CRCW04020000Z0ED; RoHS: E; ValueDisplayed: 0; Res_ohm: 0; Tolerance_%: 5%; Value1: 5%; Technology: Thick Film; Supplier 1: Digi-Key; Supplier Part Number 1: 541-0.0JCT-ND; Supplier 2: Newark; Supplier Part Number 2: 52K6543; Supplier 3: Mouser; Supplier Part Number 3: 71-CRCW0402-0-E3; AEC Grade: 0; SizeY_mm: 0.5
TP66 = CMP-0055138-1: as TP55 on sheet DC075B_POWER_SUPPLIES; PartNumber: 5001; PackageReference: Black Miniature Testpoint; CompType: Test Point; RoHS: Y; MountType: TH; ComponentLink1Description: Datasheet URL; ComponentLink1URL: http://www.keyelco.com/userAssets/file/M60-2p60.pdf; Publisher: Texas Instruments; LatestRevisionDate: 26/05/2017; Supplier 1: Digi-Key; Supplier Part Number 1: 36-5001-ND; Supplier 2: Mouser; Supplier Part Number 2: 534-5001; Color: Black; Green_EU RoHS-2: Incomplete; Green_EU RoHS: Passed
U11 = CMP-0004746-1: USB FIFO IC, 28SSOP; Manufacturer: FTDI; PartNumber: FT245RL; MountType: SMT; ComponentLink1Description: Datasheet URL; ComponentLink1URL: http://www.ftdichip.com/Support/Documents/DataSheets/ICs/DS_FT245R.pdf; RoHS: Y; PackageReference: SSOP28; Publisher: Texas Instruments; LatestRevisionDate: 09/03/2017; Supplier 1: Digi-Key; Supplier Part Number 1: 768-1011-1-ND; Supplier 2: Newark; Supplier Part Number 2: 91K9920; Supplier 3: Mouser; Supplier Part Number 3: 895-FT245RL
U12 = CMP-0065825-1: 4242-VPK Small-Footprint and Low-Power 4/0 Quad Channel Digital Isolator with Noise Filter, DBQ0016A (SSOP-16); Manufacturer: Texas Instruments; CompType: IC; U/M: EA; SizeArea_mm2: 60.0; SizeAreaWB_mm2: 96.0; SizeX_mm: 6.0; SizeY_mm: 10.0; SizeZ_mm: 1.75; PartNumber: ISO7140CCDBQR; Alternate PartNumber: ISO7140CCDBQ; PackageReference: DBQ0016A; MountType: SMT; ComponentLink1Description: Datasheet Link; ComponentLink1URL: http://www.ti.com/lit/ds/symlink/iso7141cc.pdf; RoHS: Y; Publisher: Texas Instruments; LatestRevisionDate: 2017-06-09; Alternate Manufacturer: Texas Instruments; Footprint Path 6: C:\AltiumLibraries\Footprints\TI\.PcbLib; PackageDescription: SSOP-16
U13 = CMP-0067443-1: 6-Bit Bidirectional Voltage-Level Translator with Auto Direction Sensing and +/-15-kV ESD Protect, PW0016A (TSSOP-16); Manufacturer: Texas Instruments; CompType: IC; U/M: EA; Green_Lifecycle: Active; Green_REACh: Passed; SizeArea_mm2: 32.0; SizeAreaWB_mm2: 58.8; SizeX_mm: 6.4; SizeY_mm: 5.0; SizeZ_mm: 1.2; PartNumber: TXB0106PWR; PackageReference: PW0016A; MountType: SMT; ComponentLink1Description: Datasheet Link; ComponentLink1URL: http://www.ti.com/lit/ds/symlink/txb0106.pdf; RoHS: Y; Publisher: Texas Instruments; LatestRevisionDate: 2017-06-09; Alternate Manufacturer: Texas Instruments; Footprint Path 6: C:\AltiumLibraries\Footprints\TI\.PcbLib; Green_EU RoHS-2: Passed; Green_EU RoHS: Passed; PackageDescription: TSSOP-16
U14 = CMP-0065826-1: 4242-VPK Small-Footprint and Low-Power 3/1 Quad Channel Digital Isolator with Noise Filter, DBQ0016A (SSOP-16); Manufacturer: Texas Instruments; CompType: IC; U/M: EA; SizeArea_mm2: 60.0; SizeAreaWB_mm2: 96.0; SizeX_mm: 6.0; SizeY_mm: 10.0; SizeZ_mm: 1.75; PartNumber: ISO7141CCDBQR; Alternate PartNumber: ISO7141CCDBQ; PackageReference: DBQ0016A; MountType: SMT; ComponentLink1Description: Datasheet Link; ComponentLink1URL: http://www.ti.com/lit/ds/symlink/iso7141cc.pdf; RoHS: Y; Publisher: Texas Instruments; LatestRevisionDate: 2017-06-09; Alternate Manufacturer: Texas Instruments; Footprint Path 6: C:\AltiumLibraries\Footprints\TI\.PcbLib; PackageDescription: SSOP-16